# EAGLE schematic 30V_to_1V8 (EAGLE 7.2.0)
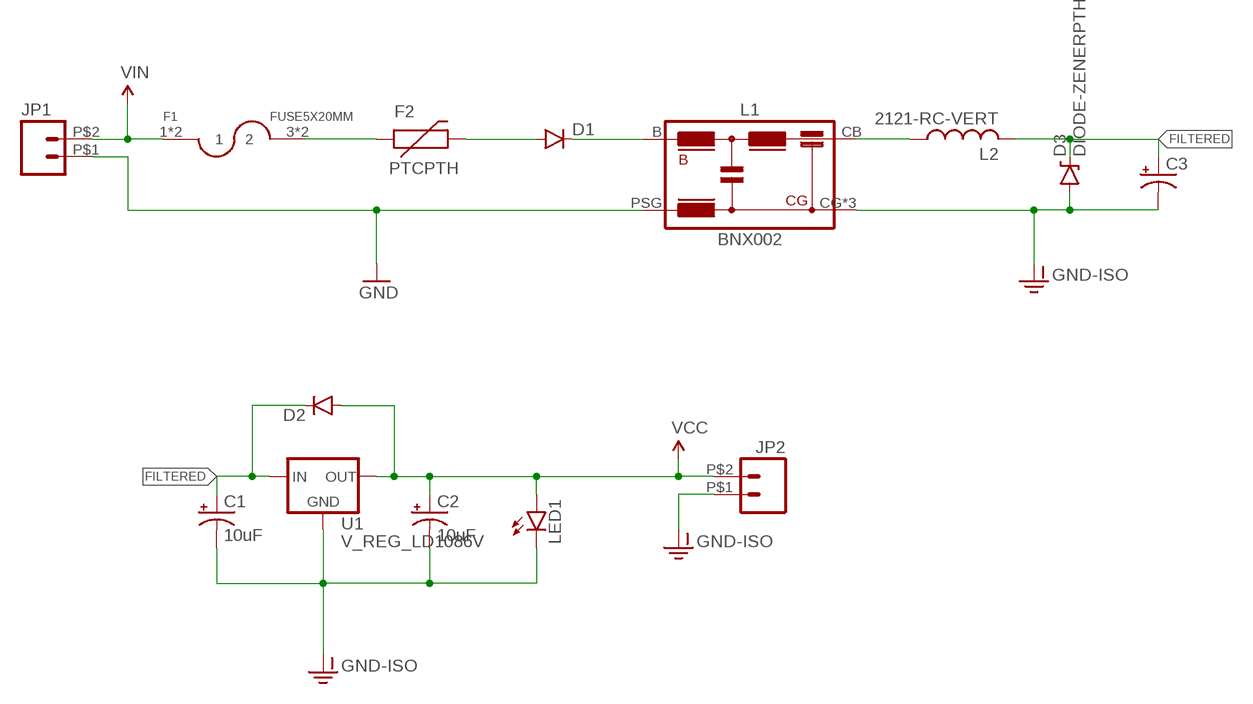
[diagram p0: schematic, sheet 1]

## Parts
C1  10uF  10UF-50V-10%(PTH)  [KEMET_E]
C2  10uF  10UF-50V-10%(PTH)  [KEMET_E]
C3  CPOL-USE10-30  [EB30D]
D1  DIODEPTH  [DIODE-1N4001]
D2  DIODEPTH  [DIODE-1N4001]
D3  DIODE-ZENERPTH  [DIODE-ZENER]
F1  FUSE5X20MM  [FUSE_1A3399]
F2  PTCPTH  [PTC]
JP1  M02TE-282834-2  [1X02_282834-2]
JP2  M02TE-282834-2  [1X02_282834-2]
L1  BNX002  [BNX002]
L2  2121-RC-VERT  [2121-RC-VERT]
LED1  LED5MM  [LED5MM]
U1  V_REG_LD1086V  [TO-220-SINGLE]

## Nets
DIODE1: D1.C L1.B
FILTERED: C1.+ C3.+ D2.C D3.P$1(C) L2.2 U1.IN
FUSE1: F1.3 F1.4 F2.P$1
FUSE2: D1.A F2.P$2
GND: JP1.P$1 L1.PSG
GND-ISO: C1.- C2.- C3.- D3.P$2(A) JP2.P$1 L1.CG L1.CG1(CG) L1.CG2(CG) LED1.K(C) U1.GND
N$1: L1.CB L2.1
VCC: C2.+ D2.A JP2.P$2 LED1.A U1.OUT
VIN: F1.1 F1.2 JP1.P$2

## Library data of the parts
C1 C2 = 1V8:10UF-50V-10%(PTH): CAP-08440
C3 = rcl:CPOL-US: POLARIZED CAPACITOR, American symbol
D1 D2 = SparkFun-DiscreteSemi:DIODE: Diode These are standard reverse protection diodes and small signal diodes. SMA package can handle up to about 1A. SOD-323 can handle about 200mA. What the SOD-323 package when ordering, there are some mfgs out there that are 5-pin packages.
D3 = SparkFun-DiscreteSemi:DIODE-ZENER: Zener Diode Production Part - 8199 3.4V Zener Voltage
F1 = DensityAltitude:FUSE5
F2 = DensityAltitude:PTC: Resettable Fuse PTC Resettable Fuse. Spark Fun Electronics SKU : COM-08357
JP1 JP2 = DensityAltitude:M02: Standard 2-pin 0.1" header. Use with - straight break away headers ( PRT-00116) - right angle break away headers (PRT-00553) - swiss pins (PRT-00743) - machine pins (PRT-00117) - female headers (PRT-00115) Molex polarized connector foot print use with: PRT-08233 with associated crimp pins and housings. 2.54_SCREWTERM for use with PRT-10571. 3.5mm Screw Terminal footprints for PRT-08084 5mm Screw Terminal footprints for use with PRT-08432
L1 = 1V8:BNX002: FILTER
L2 = DensityAltitude:2121-RC-VERT
LED1 = SparkFun-LED:LED: LEDs Standard schematic elements and footprints for 5mm, 3mm, 1206, and 0603 sized LEDs. 5mm - Spark Fun Electronics SKU : COM-00529 (and others)
U1 = DensityAltitude:V_REG_LD1086: LD1086 1.5 A adjustable and fixed low drop positive voltage regulator The LD1086 is a low drop voltage regulator capable of providing up to 1.5 A of output current. Dropout is guaranteed at a maximum of 1.2 V at the maximum output current, decreasing at lower loads. The LD1086 is pin-to-pin compatible with older 3-terminal adjustable regulators, but has better performance in terms of drop and output tolerance. Unlike PNP regulators, where a part of the output current is wasted as quiescent current, the LD1086 quiescent current flows into the load, increasing efficiency. Only a 10 μF (minimum) capacitor is needed for stability. The device is available in a TO-220, D²PAK, D²PAK/A, DPAK or DFN8 (4x4 mm) package. On-chip trimming allows the regulator to reach a very tight output voltage tolerance; within ± 1% at 25 °C. The LD1086 is available as automotive grade for adjustable output voltages in the TO-220 and DPAK packages. The PAT, SYL, SBL statistical tests have been performed, and the devices are qualified according to the AEC-Q100 specification for the automotive market in the temperature range of - 40 °C to 125 °C. Available Packages TO-220 D2PAK D2PAK/A - 3-pin w/ tabs, SMD DPAK DFN8